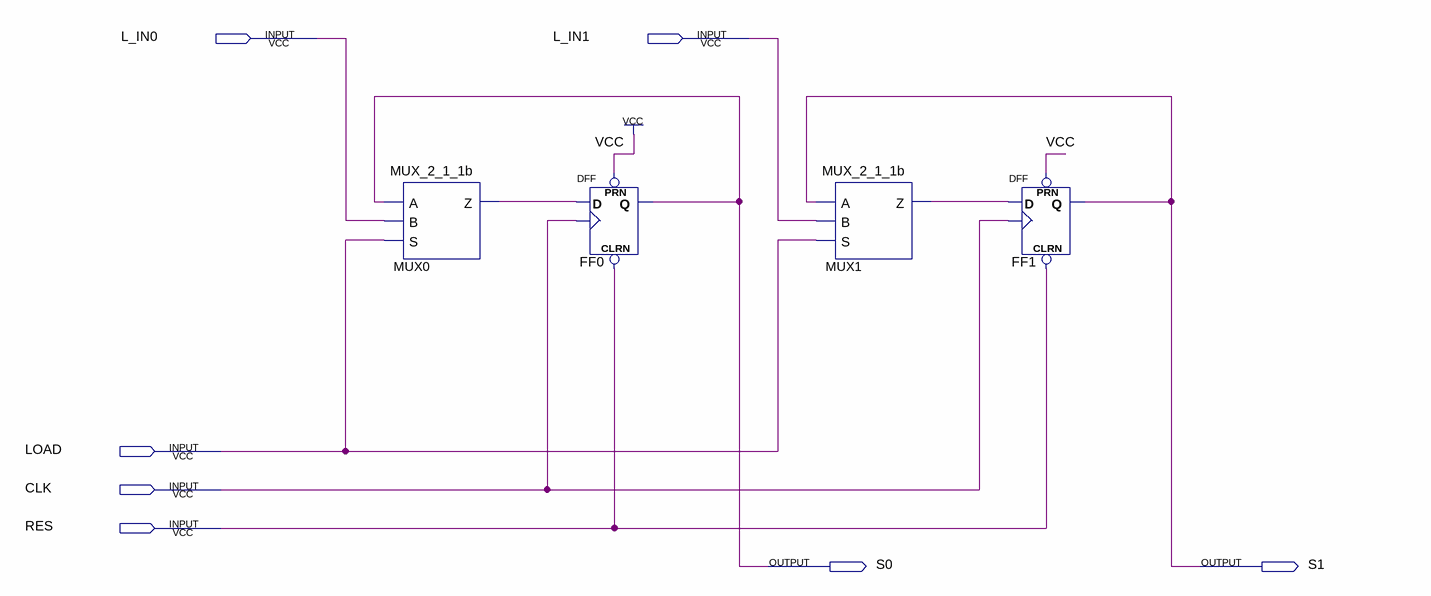
[diagram p0: schematic sheet]
// Quartus schematic REG_2b.bdf as structural Verilog: 4 symbols, 7 pins
module REG_2b (
  input  L_IN0,
  input  L_IN1,
  input  LOAD,
  input  CLK,
  input  RES,
  output S0,
  output S1
);

  wire MUX0_z, MUX1_z;

  MUX_2_1_1b MUX0 (.A(S0), .B(L_IN0), .S(LOAD), .Z(MUX0_z));
  DFF FF0 (.CLRN(RES), .CLK(CLK), .D(MUX0_z), .PRN(1'b1), .Q(S0));
  MUX_2_1_1b MUX1 (.A(S1), .B(L_IN1), .S(LOAD), .Z(MUX1_z));
  DFF FF1 (.CLRN(RES), .CLK(CLK), .D(MUX1_z), .PRN(1'b1), .Q(S1));
endmodule
